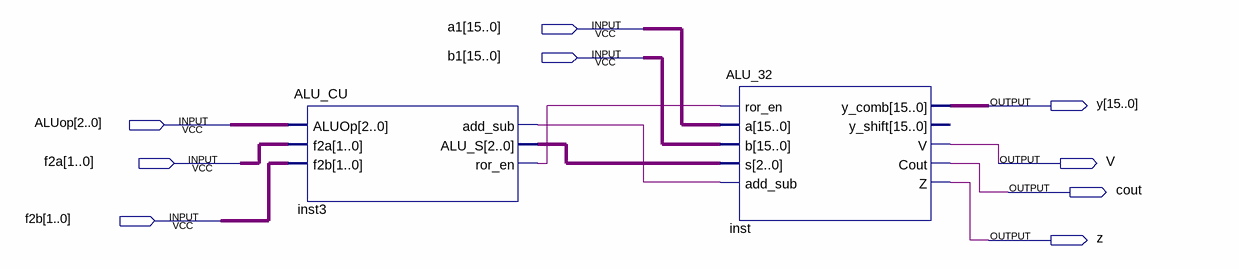
[diagram p0: schematic sheet]
// Quartus schematic ALU.bdf as structural Verilog: 2 symbols, 9 pins
module ALU (
  input  [15:0] a1,
  input  [15:0] b1,
  input  [2:0] ALUop,
  input  [1:0] f2a,
  input  [1:0] f2b,
  output [15:0] y,
  output V,
  output cout,
  output z
);

  wire inst3_add_sub, inst3_ror_en;
  wire [2:0] inst3_alu_s;

  ALU_CU inst3 (
    .ALUOp(ALUop), .f2a(f2a), .f2b(f2b), .add_sub(inst3_add_sub), .ALU_S(inst3_alu_s), .ror_en(inst3_ror_en));
  ALU_32 inst (
    .ror_en(inst3_ror_en), .a(a1), .b(b1), .s(inst3_alu_s), .add_sub(inst3_add_sub), .y_comb(y), .V(V),
    .Cout(cout), .Z(z));  // open: y_shift
endmodule
